# EAGLE design mpu (EAGLE 7.2.0)
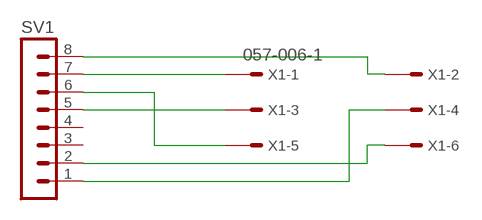
[diagram p0: schematic, sheet 1]

## Parts
SV1  MA08-1  [MA08-1]
X1  057-006-1  [057-006-1]

## Nets
5V: SV1.8 X1.2
GND: SV1.2 SV1.7 X1.1 X1.6
INTERRUPT: SV1.1 X1.4
SCL: SV1.6 X1.5
SDA: SV1.5 X1.3
Unconnected: SV1.3 SV1.4

## Library data of the parts
SV1 = con-lstb:MA08-1: PIN HEADER; OC_FARNELL: unknown; OC_NEWARK: unknown
X1 = con-panduit:057-006-: CONNECTOR 6-pin series 057 contact pc board low profile headers; OC_FARNELL: unknown; OC_NEWARK: unknown

## Board
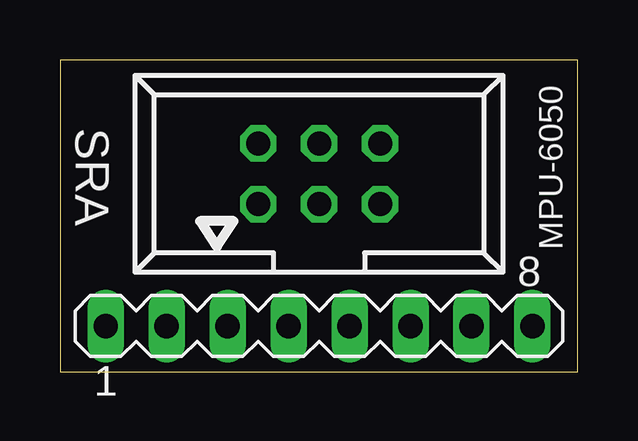
[diagram p1: board, top side]
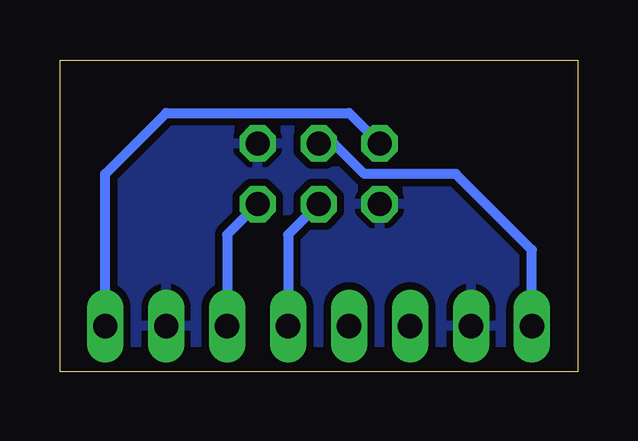
[diagram p2: board, bottom side, seen from below]

Size 21.57 x 13.01 mm. Coordinates in mm from the lower left corner, seen from the top.
Outline: 0,0 21.57,0 21.57,13.01 0,13.01 0,0
Copper layers (1*16): Top 0.035mm / dielectric 1.5mm / Bottom 0.035mm
Design rules "default": minimum track width 10mil, minimum drill 24mil, track to track 8mil, track to pad 8mil, pad to pad 8mil, via to via 8mil, smd to smd 8mil, copper to edge 40mil, drill to drill 8mil, minimum pad ring 10mil, minimum via ring 8mil, stop-mask expansion 4mil, vias tented up to drill 0mil, thermal gap 10mil

### Footprints (pad centres in the part's own frame; a part is rotated, then mirrored left to right if it is on the bottom)
MA08-1 = drill 1.016 long: 1 -8.89,0; 2 -6.35,0; 3 -3.81,0; 4 -1.27,0; 5 1.27,0; 6 3.81,0; 7 6.35,0; 8 8.89,0
057-006-1 = drill 1 octagon: 1 -2.54,-1.27; 2 -2.54,1.27; 3 0,-1.27; 4 0,1.27; 5 2.54,-1.27; 6 2.54,1.27

### Placement (x,y rotation side)
SV1  10.79,1.91 0 top
X1  10.79,8.26 0 top

### Tracks (layer width: path | path; a pad name or v marks a point on that pad's centre or on a via)
5V
  Bottom 0.406: SV1.8 19.68,8.26 17.14,10.79 9.53,10.79 X1.2
GND
  pour Bottom (isolate 0.305): 0,13.34 21.59,13.34 21.59,0 0,0
INTERRUPT
  Bottom 0.406: SV1.1 1.91,5.08 5.08,8.26 8.89,8.26 10.16,9.53 X1.4
SCL
  Bottom 0.406: SV1.6 14.61,5.71 X1.5
SDA
  Bottom 0.406: SV1.5 12.06,5.71 X1.3

### Text on the board
tNames: SRA | MPU-6050